# EAGLE design lsm_cpu (EAGLE 7.4.0)
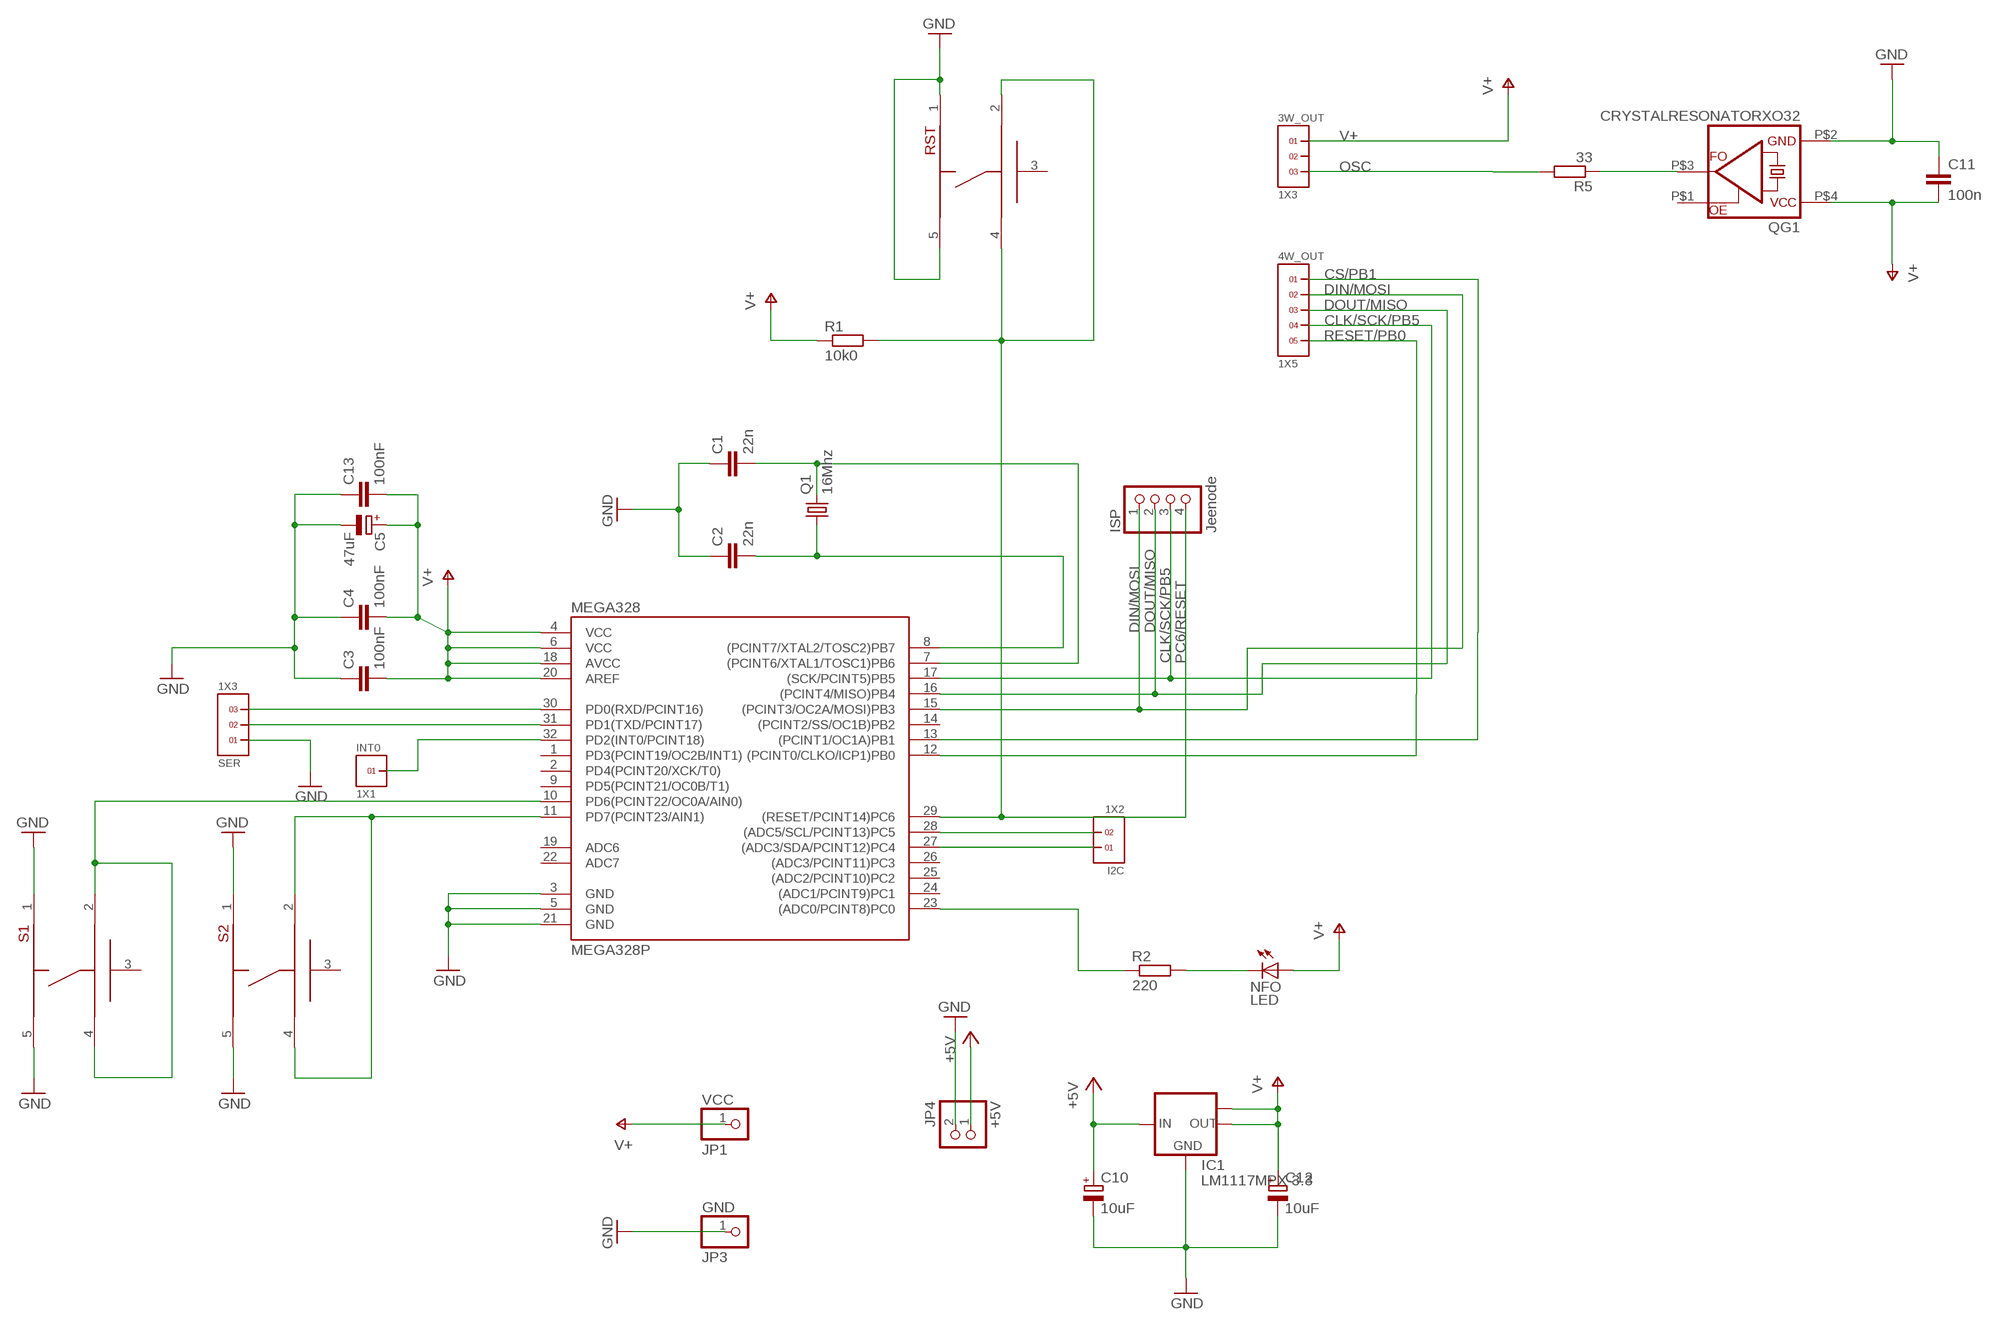
[diagram p0: schematic, sheet 1]

## Parts
3W_OUT  1X3  [1X3]
4W_OUT  1X5  [1X5]
+5V  JP4  PINHD-1X2  [1X02]
C1  22n  C-EUC1206  [C1206]
C2  22n  C-EUC1206  [C1206]
C3  100nF  C-EUC1206  [C1206]
C4  100nF  C-EUC1206  [C1206]
C5  47uF  CPOL-EUE2-4  [E2-4]
C10  10uF  CPOL-EUE2-4  [E2-4]
C11  100n  C-EUC1206  [C1206]
C12  10uF  CPOL-EUE2-4  [E2-4]
C13  100nF  C-EUC1206  [C1206]
GND  JP3  PINHD-1X1  [1X01]
I2C  1X2  [1X2]
IC1  LM1117MPX-3.3  [SOT223]
INT0  1X1  [1X1]
ISP  Jeenode  PINHD-1X4  [1X04]
MEGA328  MEGA328P  [TQFP32-08]
NFO  LED  LEDSML1206  [SML1206]
Q1  16Mhz  CRYSTALMT  [MT]
QG1  CRYSTALRESONATORXO32  [XO32]
R1  10k0  R-EU_R0805  [R0805]
R2  220  R-EU_R0805  [R0805]
R5  33  R-EU_R0805  [R0805]
RST  KMSXXXG  [C&K-KMS-SWITCH]
S1  KMSXXXG  [C&K-KMS-SWITCH]
S2  KMSXXXG  [C&K-KMS-SWITCH]
SER  1X3  [1X3]
VCC  JP1  PINHD-1X1  [1X01]

## Nets
+5V [5v_power]: +5V.1 C10.+ IC1.3(IN)
CLK/SCK/PB5: 4W_OUT.4 ISP.3 MEGA328.17((SCK/PCINT5)PB5)
CS/PB1: 4W_OUT.1 MEGA328.13((PCINT1/OC1A)PB1)
DIN/MOSI: 4W_OUT.2 ISP.1 MEGA328.15((PCINT3/OC2A/MOSI)PB3)
DOUT/MISO: 4W_OUT.3 ISP.2 MEGA328.16((PCINT4/MISO)PB4)
GND [GND]: +5V.2 C1.1 C2.1 C3.1 C4.1 C5.- C10.- C11.1 C12.- C13.1 GND.1 IC1.1(GND) MEGA328.3(GND) MEGA328.5(GND) MEGA328.21(GND) QG1.P$2(GND) RST.1 RST.5 S1.1 S1.5 S2.1 S2.5 SER.1
N$1: MEGA328.11(PD7(PCINT23/AIN1)) S2.2 S2.4
N$2: MEGA328.10(PD6(PCINT22/OC0A/AIN0)) S1.2 S1.4
N$7: C1.2 MEGA328.7((PCINT6/XTAL1/TOSC1)PB6) Q1.P3
N$8: C2.2 MEGA328.8((PCINT7/XTAL2/TOSC2)PB7) Q1.P1
N$10: NFO.C R2.2
N$15: QG1.P$3(FO) R5.1
OSC: 3W_OUT.3 R5.2
PC0: MEGA328.23((ADC0/PCINT8)PC0) R2.1
PC6/RESET: ISP.4 MEGA328.29((RESET/PCINT14)PC6) R1.2 RST.2 RST.4
PD2/INT0/PCINT18: INT0.1 MEGA328.32(PD2(INT0/PCINT18))
RESET/PB0: 4W_OUT.5 MEGA328.12((PCINT0/CLKO/ICP1)PB0)
RXD: MEGA328.30(PD0(RXD/PCINT16)) SER.3
SCL: I2C.2 MEGA328.28((ADC5/SCL/PCINT13)PC5)
SDA: I2C.1 MEGA328.27((ADC3/SDA/PCINT12)PC4)
TXD: MEGA328.31(PD1(TXD/PCINT17)) SER.2
V+ [power]: 3W_OUT.1 C3.2 C4.2 C5.+ C11.2 C12.+ C13.2 IC1.2(OUT) IC1.TAB(OUT1) MEGA328.4(VCC) MEGA328.6(VCC) MEGA328.18(AVCC) MEGA328.20(AREF) NFO.A QG1.P$4(VCC) R1.1 VCC.1
Unconnected: 3W_OUT.2 MEGA328.1(PD3(PCINT19/OC2B/INT1)) MEGA328.2(PD4(PCINT20/XCK/T0)) MEGA328.9(PD5(PCINT21/OC0B/T1)) MEGA328.14((PCINT2/SS/OC1B)PB2) MEGA328.19(ADC6) MEGA328.22(ADC7) MEGA328.24((ADC1/PCINT9)PC1) MEGA328.25((ADC2/PCINT10)PC2) MEGA328.26((ADC3/PCINT11)PC3) Q1.P2(GND) Q1.P4(GND1) QG1.P$1(OE) RST.3 S1.3 S2.3

## Library data of the parts
3W_OUT SER = pinheaders_2mm:1X3
4W_OUT = pinheaders_2mm:1X5
+5V = pinhead:PINHD-1X2: PIN HEADER
C1-C4 C11 C13 = rcl:C-EU: CAPACITOR, European symbol
C5 C10 C12 = rcl:CPOL-EU: POLARIZED CAPACITOR, European symbol
GND VCC = pinhead:PINHD-1X1: PIN HEADER
I2C = pinheaders_2mm:1X2
IC1 = lm1117:LM1117MPX-*
INT0 = pinheaders_2mm:1X1
ISP = pinhead:PINHD-1X4: PIN HEADER
MEGA328 = led-stuff:MEGA328P
NFO = led:LED: LED OSRAM: - CHIPLED LG R971, LG N971, LY N971, LG Q971, LY Q971, LO R971, LY R971 LH N974, LH R974 LS Q976, LO Q976, LY Q976 LO Q996 - Hyper CHIPLED LW Q18S LB Q993, LB Q99A, LB R99A - SideLED LS A670, LO A670, LY A670, LG A670, LP A670 LB A673, LV A673, LT A673, LW A673 LH A674 LY A675 LS A676, LA A676, LO A676, LY A676, LW A676 LS A679, LY A679, LG A679 - Hyper Micro SIDELED® LS Y876, LA Y876, LO Y876, LY Y876 LT Y87S - SmartLED LW L88C, LW L88S LB L89C, LB L89S, LG L890 LS L89K, LO L89K, LY L89K LS L896, LA L896, LO L896, LY L896 - TOPLED LS T670, LO T670, LY T670, LG T670, LP T670 LSG T670, LSP T670, LSY T670, LOP T670, LYG T670 LG T671, LOG T671, LSG T671 LB T673, LV T673, LT T673, LW T673 LH T674 LS T676, LA T676, LO T676, LY T676, LB T676, LH T676, LSB T676, LW T676 LB T67C, LV T67C, LT T67C, LS T67K, LO T67K, LY T67K, LW E67C LS E67B, LA E67B, LO E67B, LY E67B, LB E67C, LV E67C, LT E67C LW T67C LS T679, LY T679, LG T679 LS T770, LO T770, LY T770, LG T770, LP T770 LB T773, LV T773, LT T773, LW T773 LH T774 LS E675, LA E675, LY E675, LS T675 LS T776, LA T776, LO T776, LY T776, LB T776 LHGB T686 LT T68C, LB T68C - Hyper Mini TOPLED® LB M676 - Mini TOPLED Santana® LG M470 LS M47K, LO M47K, LY M47K Source: http://www.osram.convergy.de LUXEON: - LUMILED® LXK2-PW12-R00, LXK2-PW12-S00, LXK2-PW14-U00, LXK2-PW14-V00 LXK2-PM12-R00, LXK2-PM12-S00, LXK2-PM14-U00 LXK2-PE12-Q00, LXK2-PE12-R00, LXK2-PE12-S00, LXK2-PE14-T00, LXK2-PE14-U00 LXK2-PB12-K00, LXK2-PB12-L00, LXK2-PB12-M00, LXK2-PB14-N00, LXK2-PB14-P00, LXK2-PB14-Q00 LXK2-PR12-L00, LXK2-PR12-M00, LXK2-PR14-Q00, LXK2-PR14-R00 LXK2-PD12-Q00, LXK2-PD12-R00, LXK2-PD12-S00 LXK2-PH12-R00, LXK2-PH12-S00 LXK2-PL12-P00, LXK2-PL12-Q00, LXK2-PL12-R00 Source: www.luxeon.com KINGBRIGHT: KA-3528ASYC Source: www.kingbright.com
Q1 = Crystals-new:CRYSTAL
QG1 = Crystals-new:CRYSTALRESONATOR
R1 R2 R5 = rcl:R-EU_: RESISTOR, European symbol
RST S1 S2 = domestichacks:KMSXXXG: C&K KMS Series Microminiature SMT Side Actuated KMS221G KMS223G KMS231G KMS233G

## Net classes
0 default: width 0.203 mm, clearance 0.254 mm
1 power: width 0.406 mm, clearance 0.254 mm
2 GND: width 0.406 mm, clearance 0.254 mm
3 5v_power: width 0.61 mm, clearance 0.203 mm

## Board
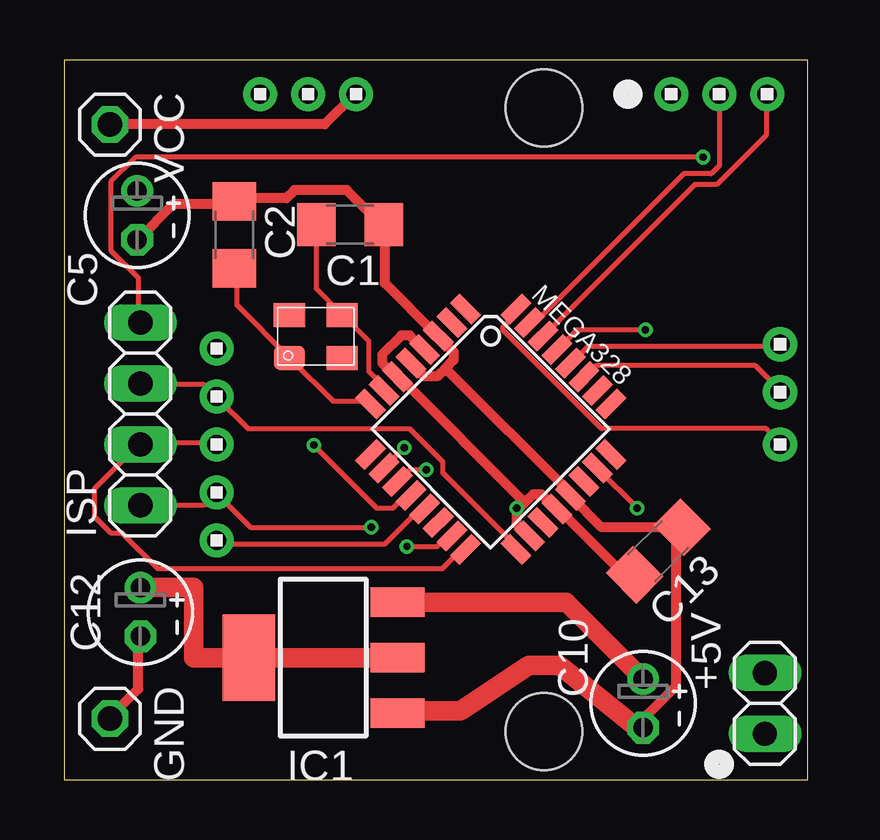
[diagram p1: board, top side]
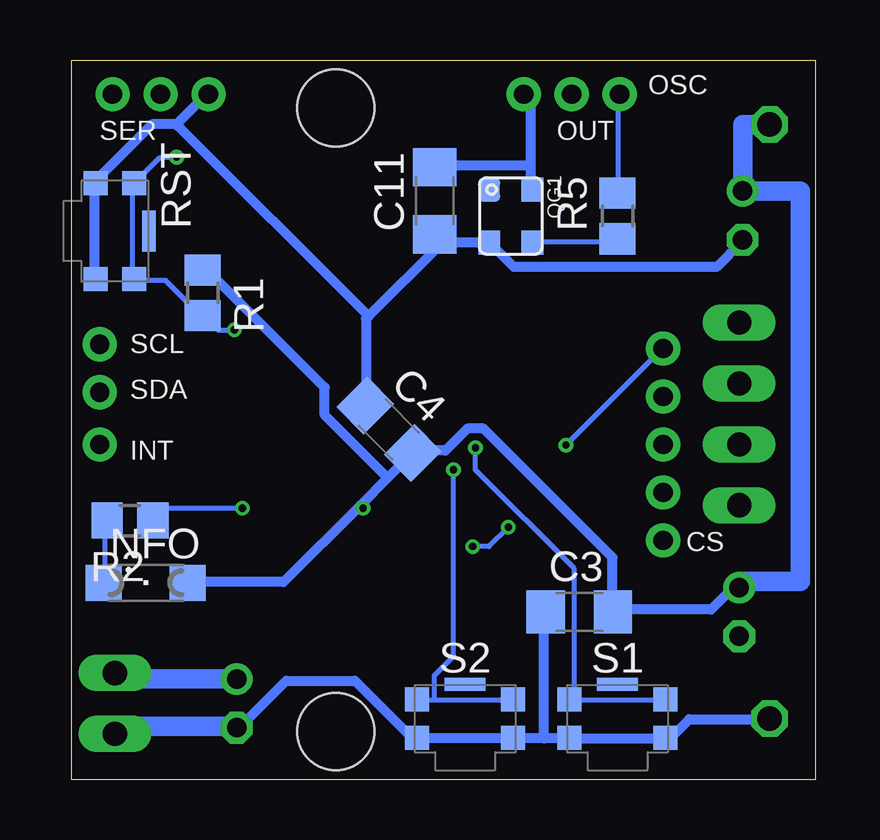
[diagram p2: board, bottom side, seen from below]

Size 31 x 30 mm. Coordinates in mm from the lower left corner, seen from the top.
Outline: 0,0 31,0 31,30 0,30 0,0
Copper layers (1*16): Top 0.035mm / dielectric 1.5mm / Bottom 0.035mm
Design rules "Elecrow_2-layer_eagle_rule": minimum track width 6mil, minimum drill 12mil, track to track 6mil, track to pad 6mil, pad to pad 6mil, via to via 6mil, smd to smd 0mil, copper to edge 10mil, drill to drill 10mil, minimum pad ring 10mil, minimum via ring 6mil, stop-mask expansion 2mil, vias tented up to drill 100mil, thermal gap 10mil
Holes 3.2 mm at 20,28 20,2

### Footprints (pad centres in the part's own frame; a part is rotated, then mirrored left to right if it is on the bottom)
1X3 = drill 0.8 pad 1.422: 1 -2,0; 2 0,0; 3 2,0
1X5 = drill 0.8 pad 1.422: 1 -4,0; 2 -2,0; 3 0,0; 4 2,0; 5 4,0
1X02 = drill 1.016 long: 1 -1.27,0; 2 1.27,0
C1206 = smd 1.6 x 1.8: 1 -1.4,0; 2 1.4,0
E2-4 = drill 0.813 pad 1.27: + -1.016,0 | drill 0.813 pad 1.27 octagon: - 1.016,0
1X01 = drill 1.016 octagon: 1 0,0
1X2 = drill 0.8 pad 1.422: 1 -1,0; 2 1,0
SOT223 = smd 1.219 x 2.235: 1 -2.311,-3.099; 2 0,-3.099; 3 2.311,-3.099 | smd 3.6 x 2.2: TAB 0,3.099
1X1 = drill 0.8 pad 1.422: 1 0,0
1X04 = drill 1.016 long: 1 -3.81,0; 2 -1.27,0; 3 1.27,0; 4 3.81,0
TQFP32-08 = smd 1.27 x 0.559: 1 -4.293,2.8; 2 -4.293,2; 3 -4.293,1.2; 4 -4.293,0.4; 5 -4.293,-0.4; 6 -4.293,-1.2; 7 -4.293,-2; 8 -4.293,-2.8; 17 4.293,-2.8; 18 4.293,-2; 19 4.293,-1.2; 20 4.293,-0.4; 21 4.293,0.4; 22 4.293,1.2; 23 4.293,2; 24 4.293,2.8 | smd 0.559 x 1.27: 9 -2.8,-4.293; 10 -2,-4.293; 11 -1.2,-4.293; 12 -0.4,-4.293; 13 0.4,-4.293; 14 1.2,-4.293; 15 2,-4.293; 16 2.8,-4.293; 25 2.8,4.293; 26 2,4.293; 27 1.2,4.293; 28 0.4,4.293; 29 -0.4,4.293; 30 -1.2,4.293; 31 -2,4.293; 32 -2.8,4.293
SML1206 = smd 1.5 x 1.5: A 1.75,0; C -1.75,0
MT = smd 1.3 x 1: P1 -1.1,-0.9; P2 1.1,-0.9; P3 1.1,0.9; P4 -1.1,0.9
XO32 = smd 1 x 0.9: P$1 -1.1,-0.9; P$2 1.1,-0.9; P$3 1.1,0.9; P$4 -1.1,0.9
R0805 = smd 1.3 x 1.5: 1 -0.95,0; 2 0.95,0
C&K-KMS-SWITCH = smd 1 x 1: 1 -2,-0.8; 2 -2,0.8; 4 2,0.8; 5 2,-0.8 | smd 1.7 x 0.55: 3 0,1.425

### Placement (x,y rotation side)
3W_OUT  10.16,28.57 180 top
4W_OUT  6.35,13.97 90 top
+5V  29.21,3.17 270 top
C1  11.91,23.14 180 top
C2  7.09,22.71 270 top
C3  9.84,6.99 0 bottom
C4  17.78,14.61 315 bottom
C5  3.04,23.52 270 top
C10  24.13,3.17 270 top
C11  15.88,24.13 90 bottom
C12  3.17,6.99 270 top
C13  24.77,9.53 225 top
GND  1.91,2.54 270 top
I2C  29.84,17.14 90 top
IC1  10.79,5.08 90 top
INT0  29.84,13.97 0 top
ISP  3.17,15.24 90 top
MEGA328  17.78,14.61 315 top
NFO  27.91,8.21 0 bottom
Q1  10.48,18.48 0 top
QG1  12.7,23.5 270 bottom
R1  25.55,20.3 270 bottom
R2  28.57,10.79 180 bottom
R5  8.26,23.5 90 bottom
RST  29.21,22.86 270 bottom
S1  8.26,2.54 0 bottom
S2  14.61,2.54 0 bottom
SER  27.3,28.57 0 top
VCC  1.91,27.3 270 top

### Tracks (layer width: path | path; a pad name or v marks a point on that pad's centre or on a via)
+5V
  Top 0.813: IC1.3 20.93,7.39 C10.+
  Bottom 0.813: C10.+ 28.96,4.19 +5V.1
CLK/SCK/PB5
  Top 0.203: MEGA328.17 18.75,9.6 18.75,9.83 15.77,12.8 15.77,13.26 14.4,14.63 7.66,14.63 6.4,15.89 4W_OUT.4 6.29,16 5.83,16.46 3.2,16.46 ISP.3
CS/PB1
  Top 0.203: MEGA328.13 14.97,11.2 14.74,11.2 13.37,9.83 6.51,9.83 6.4,9.94 4W_OUT.1
DIN/MOSI  (via drill 0.3)
  Top 0.203: v14.29,9.72 15.54,9.72 15.89,10.06 16.12,10.06 MEGA328.15 | v12.8,10.52 7.77,10.52 6.4,11.89 4W_OUT.2 6.29,11.89 5.83,11.43 3.2,11.43 ISP.1
  Bottom 0.203: v14.29,9.72 13.6,9.72 v12.8,10.52
DOUT/MISO
  Top 0.203: MEGA328.16 16.69,9.49 16.46,9.49 15.77,8.8 3.89,8.8 2.4,10.29 1.94,10.29 1.26,10.97 1.26,12.12 3.09,13.95 ISP.2 3.2,14.06 6.29,14.06 4W_OUT.3
GND
  Top 0.406: C12.- 3.09,5.94 3.09,3.77 1.94,2.63 GND.1 | C5.- 3.09,22.52 4.57,24 7.09,24 C2.1 7.2,24.23 9.26,24.23 9.6,24.57 11.77,24.57 13.14,23.2 C1.1 13.37,23.09 13.37,20.69 15.54,18.52 MEGA328.3 15.66,18.4 16.23,17.83 16.23,17.49 15.89,17.14 | 15.89,17.14 15.54,16.8 14.97,16.8 14.52,17.26 MEGA328.5 | 15.89,17.14 16,17.03 21.03,12 MEGA328.21 21.14,11.77 22.4,10.52 25.72,10.52 C13.1 25.49,10.4 25.49,3.89 24.35,2.74 24.35,2.52 C10.-
  Top 0.813: C10.- 23.88,2.16 20.64,4.76 19.37,4.76 16.51,2.86 13.98,2.86 IC1.1
  Bottom 0.406: 11.32,1.71 10.4,1.71 S1.1 10.17,1.71 6.29,1.71 S1.5 6.06,1.71 5.26,2.52 1.94,2.52 GND.1 | 11.32,1.71 12.57,1.71 S2.5 12.8,1.71 16.57,1.71 S2.1 16.8,1.71 19.2,4.12 22.06,4.12 23.77,2.4 C10.- | C3.1 11.32,6.97 11.32,1.83 11.32,1.71 | RST.5 30.06,20.92 30.06,24.8 RST.1 29.95,25.03 27.66,27.32 26.63,27.32 | 26.63,27.32 25.38,28.57 SER.1 | 18.63,19.32 15.66,22.29 C11.1 15.77,22.63 15.54,22.4 13.6,22.4 QG1.P$2 13.49,22.29 12.57,21.37 4.12,21.37 3.09,22.4 C5.- | 18.63,19.32 18.75,19.2 18.75,15.66 C4.1 | 26.63,27.32 26.52,27.2 18.75,19.43 18.63,19.32
  Bottom 0.813: C10.- 24.13,2.22 28.89,2.22 +5V.2
N$1  (via drill 0.3)
  Top 0.203: v15.09,12.92 14.4,12.92 13.95,12.46 MEGA328.11
  Bottom 0.203: 15.89,3.31 16.57,3.31 S2.2 | 15.89,3.31 12.69,3.31 S2.4 | v15.09,12.92 15.09,5.14 15.89,4.34 15.89,3.31
N$2  (via drill 0.3)
  Top 0.203: v14.17,13.83 13.37,13.03 MEGA328.10
  Bottom 0.203: 10.06,3.31 10.17,3.31 S1.2 10.06,3.31 | 10.06,3.31 6.29,3.31 S1.4 | v14.17,13.83 14.17,12.92 10.06,8.8 10.06,3.31
N$7
  Top 0.203: MEGA328.7 13.26,16.23 13.26,16.46 12.69,17.03 12.69,18.29 11.66,19.32 Q1.P3 11.54,19.43 10.52,20.46 10.52,23.09 C1.2
N$8
  Top 0.203: MEGA328.8 12.69,15.77 11.2,15.77 9.49,17.49 Q1.P1 9.37,17.6 7.2,19.77 7.2,21.26 C2.2
N$10
  Bottom 0.203: R2.2 29.6,10.74 29.6,8.23 NFO.C
N$15
  Bottom 0.203: QG1.P$3 11.77,22.4 8.46,22.4 8.34,22.52 R5.1
OSC
  Bottom 0.203: R5.2 8.23,24.46 8.23,28.57 3W_OUT.3
PC0  (via drill 0.3)
  Top 0.203: v23.89,11.32 22.29,12.92 MEGA328.23
  Bottom 0.203: v23.89,11.32 27.09,11.32 27.55,10.86 R2.1
PC6/RESET  (via drill 0.3)
  Top 0.203: v24.23,18.75 21.37,18.75 20.57,17.95 MEGA328.29 | v26.63,25.95 2.97,25.95 1.94,24.92 1.94,22.06 3.09,20.92 3.09,19.09 ISP.4
  Bottom 0.203: v24.23,18.75 24.92,18.75 25.49,19.32 R1.2 25.6,19.32 27.09,20.8 28.35,20.8 RST.4 28.46,20.92 28.46,24.8 RST.2 28.35,24.92 27.32,25.95 v26.63,25.95
PD2/INT0/PCINT18
  Top 0.203: MEGA328.32 18.75,19.55 18.75,19.32 18.29,18.86 18.29,18.75 22.4,14.63 29.26,14.63 29.83,14.06 INT0.1
RESET/PB0  (via drill 0.3)
  Top 0.203: v10.4,13.95 13.03,11.32 13.72,11.32 14.17,11.77 14.4,11.77 MEGA328.12
  Bottom 0.203: v10.4,13.95 6.4,17.95 4W_OUT.5
RXD
  Top 0.203: MEGA328.30 20,18.52 26.29,24.8 27.2,24.8 29.26,26.86 29.26,28.57 SER.3
SCL
  Top 0.203: MEGA328.28 21.14,17.37 21.83,18.06 29.83,18.06 I2C.2
SDA
  Top 0.203: MEGA328.27 21.72,16.8 22.17,17.26 28.8,17.26 29.83,16.23 I2C.1
TXD
  Top 0.203: MEGA328.31 19.43,19.09 19.66,19.09 25.83,25.26 26.98,25.26 27.32,25.6 27.32,28.57 SER.2
V+  (via drill 0.3)
  Top 0.406: MEGA328.4 14.97,17.95 14.4,18.52 14.06,18.52 13.26,17.72 13.26,17.37 13.83,16.8 MEGA328.6 14.06,16.69 19.09,11.66 19.2,11.54 | 18.86,11.2 18.86,10.63 19.32,10.17 MEGA328.18 | 19.2,11.54 19.55,11.89 19.89,11.89 20.46,11.32 MEGA328.20 20.69,11.2 23.32,8.57 23.77,8.57 C13.2 | 19.2,11.54 18.86,11.2 | v18.86,11.32 18.86,11.2 | VCC.1 1.94,27.32 10.86,27.32 12.12,28.57 3W_OUT.1
  Top 0.813: C12.+ 5.4,8 5.4,5.08 IC1.TAB IC1.2
  Bottom 0.406: 17.83,12.57 16.8,13.6 C4.2 16.69,13.72 15.43,13.72 14.52,14.63 13.83,14.63 8.46,9.26 8.46,7.2 C3.2 8.34,7.09 4.34,7.09 3.54,7.89 C12.+ | 17.83,12.57 18.97,11.43 | 18.97,11.43 22.17,8.23 26.06,8.23 NFO.A | R1.1 25.49,21.14 25.26,21.14 20.46,16.34 20.46,15.2 17.95,12.69 17.83,12.57 | v18.86,11.32 18.97,11.43 | 11.89,25.6 11.89,28.35 12.12,28.57 3W_OUT.1 | 11.89,25.6 11.89,24.69 QG1.P$4 | C11.2 15.77,25.6 12,25.6 11.89,25.6
  Bottom 0.813: VCC.1 3.04,27.3 C5.+ 0.64,24.54 0.64,8.26 3.17,8.26 C12.+

### Text on the board
bNames: OSC | OUT | SER | SCL | SDA | INT | CS